# Altium schematic sheet Sheet1.SchDoc
size 209 x 297 mm; Address1: Address1; Address2: Address2; Address3: Address3; Address4: Address4; DocumentNumber: АБВГ.123456.001 Э3; SheetNumber: 1; SheetTotal: 1; Scale: 1:1; DocumentType: Схема электрическая принципиальная; FirstReferrence: АБВГ.123456.001
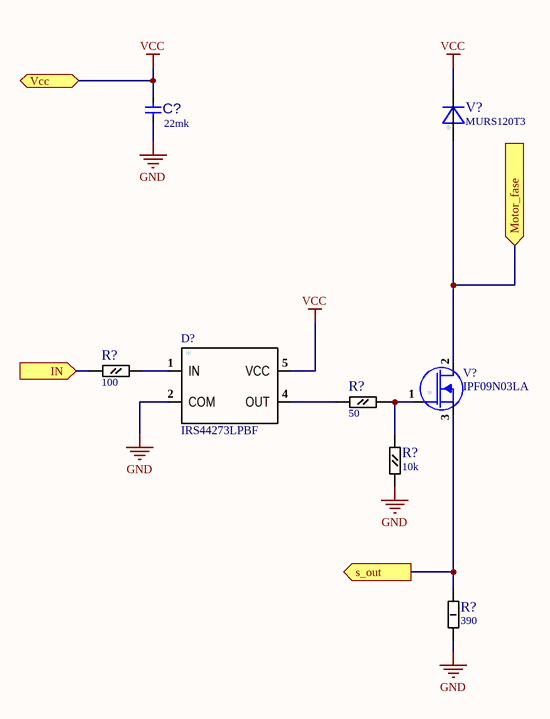
[diagram p0: Sheet1.SchDoc]

## Parts
(Parts that share a designator on the sheet are numbered #1, #2 ... from top to bottom, then left to right.)
C?  value 22mk  [C1210]  (hidden comment: C1210)
D?  IRS44273LPBF  [SOT23-5]
R?#1  value 100  [R0805]  (hidden comment: R0805-0,125 W)
R?#2  value 50  [R0805]  (hidden comment: R0805-0,125 W)
R?#3  value 10k  [R0805]  (hidden comment: R0805-0,125 W)
R?#4  value 390  [R2512]  (hidden comment: R2512-1 W)
V?#1  MURS120T3  [SMB]
V?#2  IPF09N03LA  [TO-252(DPAK)]

## Ports
IN (in), Motor_fase (in), s_out (out), Vcc

## Nets
GND: C?.1 D?.2(COM) R?#3.1 R?#4.1
VCC: C?.2 D?.5(VCC) V?#1.1(K) ; port Vcc
IN: R?#1.1 ; port IN
Motor_fase: V?#1.2(A) V?#2.2(D) ; port Motor_fase
s_out: R?#4.2 V?#2.3(S) ; port s_out
NetD?_1: D?.1(IN) R?#1.2
NetD?_4: D?.4(OUT) R?#2.1
NetR?#2_2: R?#2.2 R?#3.2 V?#2.1(G)

## Notes on the sheet
- Перв. примен.
- Справ. №
- Подп. и дата
- Инв. № дубл.
- Взам. инв. №
- Разраб.
- Изм.
- Лист
- № докум.
- Подп.
- Дата
- Лит.
- Масса
- Масштаб
- Пров.
- Т.контр.
- Листов
- Инв. № подл.
- Утв.
- Н.контр.
- 2.106-A4
- Копировал
- Формат А4

## Library data of the parts
C? = Condensator 1210 47mk: TitAD: Конденсатор; Part Number: Condensator 1210 47mk
D? = IRS44273LPBF: TitAD: Драйвер MOSFET; Part Number: IRS44273LPBF
R?#1-R?#3 = Resistor 0805 100: TitAD: Резистор; Part Number: Resistor 0805 100; Корпус: R0805
R?#4 = Resistor 2512 390: TitAD: Резистор; Part Number: Resistor 2512 390
V?#1 = MURS120T3: TitAD: Ultrafast Power Rectifiers; Supplier 1: Mouser; Supplier Part Number 1: 625-1N4007E-E3/73; Part Number: MURS120T3; Корпус: SMB
V?#2 = IPF09N03LA: TitAD: Транзистор; Part Number: IPF09N03LA; ManufacturerPartNumber: IPF09N03LA; Корпус: TO-252(DPAK)